# Altium schematic sheet be_mdv.SchDoc: =GlobalProjectName
size 410 x 297 mm; DocumentNumber: 1; SheetNumber: 1; SheetTotal: 2; PageSetup: Record=PageOptions|CenterHorizontal=True|CenterVertical=True|PrintScale=1.00|XCorrection=1.00|YCorrection=1.00|PrintKind=1|BorderSize=5000000|LeftOffset=0|BottomOffset=0|Orientation=2|PaperLength=1000|PaperWidth=1000|Scale=100|PaperSource=15|PrintQuality=1200|MediaType=1|DitherType=10|PaperKind=A3|PrintScaleMode=1; Weight: -; ScaleFactor: -
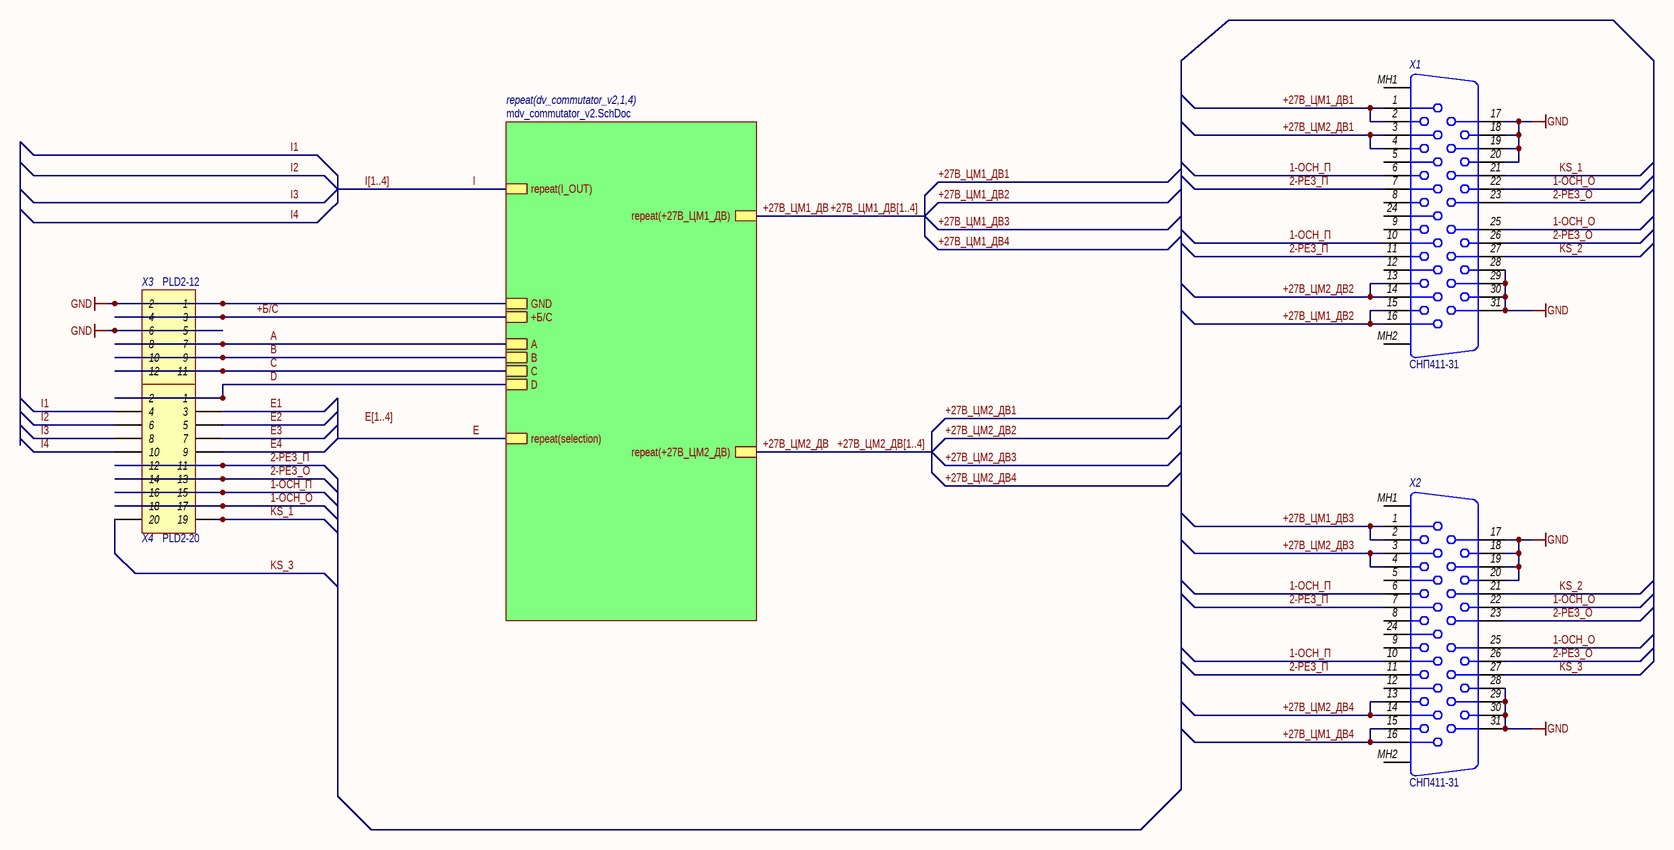
[diagram p0: be_mdv.SchDoc]

## Parts
X1  SNP411-31  [SNP411-31]  (value not drawn)
X2  SNP411-31  [SNP411-31]  (value not drawn)
X3  Header 2X12  [PLD2-12]  (value not drawn)
X4  Header 2X20  [PLD2-20]  (value not drawn)

## Sub-sheets
repeat(dv_commutator_v2,1,4) = mdv_commutator_v2.SchDoc: repeat(+27В_ЦМ2_ДВ), GND, repeat(+27В_ЦМ1_ДВ), +Б/С, repeat(selection), A, C, B, D, repeat(I_OUT)

## Nets
GND: X1.17 X1.18 X1.19 X1.20 X1.28 X1.29 X1.30 X1.31 X2.17 X2.18 X2.19 X2.20 X2.28 X2.29 X2.30 X2.31 X3.1 X3.2 X3.5 X3.6 ; sheet repeat(dv_commutator_v2,1,4)/GND
1-ОСН_О: X1.22 X1.25 X2.22 X2.25 X4.17 X4.18
1-ОСН_П: X1.6 X1.10 X2.6 X2.10 X4.15 X4.16
2-РЕЗ_О: X1.23 X1.26 X2.23 X2.26 X4.13 X4.14
2-РЕЗ_П: X1.7 X1.11 X2.7 X2.11 X4.11 X4.12
+27В_ЦМ1_ДВ: sheet repeat(dv_commutator_v2,1,4)/repeat(+27В_ЦМ1_ДВ)  [also labelled +27В_ЦМ1_ДВ[1..4]]
+27В_ЦМ1_ДВ1: X1.1 X1.2
+27В_ЦМ1_ДВ2: X1.15 X1.16
+27В_ЦМ1_ДВ3: X2.1 X2.2
+27В_ЦМ1_ДВ4: X2.15 X2.16
+27В_ЦМ2_ДВ: sheet repeat(dv_commutator_v2,1,4)/repeat(+27В_ЦМ2_ДВ)  [also labelled +27В_ЦМ2_ДВ[1..4]]
+27В_ЦМ2_ДВ1: X1.3 X1.4
+27В_ЦМ2_ДВ2: X1.13 X1.14
+27В_ЦМ2_ДВ3: X2.3 X2.4
+27В_ЦМ2_ДВ4: X2.13 X2.14
+Б/С: X3.3 X3.4 ; sheet repeat(dv_commutator_v2,1,4)/+Б/С
A: X3.7 X3.8 ; sheet repeat(dv_commutator_v2,1,4)/A
B: X3.9 X3.10 ; sheet repeat(dv_commutator_v2,1,4)/B
C: X3.11 X3.12 ; sheet repeat(dv_commutator_v2,1,4)/C
D: X4.1 X4.2 ; sheet repeat(dv_commutator_v2,1,4)/D
E: sheet repeat(dv_commutator_v2,1,4)/repeat(selection)
E1: X4.3
E2: X4.5
E3: X4.7
E4: X4.9
I: sheet repeat(dv_commutator_v2,1,4)/repeat(I_OUT)
I1: X4.4
I2: X4.6
I3: X4.8
I4: X4.10
KS_1: X1.21 X4.19
KS_2: X1.27 X2.21
KS_3: X2.27 X4.20

Not connected (* = marked no-connect by the designer): X1 5 8 9 12 24 MH1 MH2; X2 5 8 9 12 24 MH1 MH2

## Buses and harness runs
bus E[1..4]
bus I[1..4]

## Notes on the sheet
- Labels drawn without touching a wire or pin: E[1..4]
- Перв. примен.
- Справ. №
- Подп. и дата
- Инв. № дубл.
- Взам. инв. №
- Изм.
- Разраб.
- Лист
- № докум.
- Подп.
- Дата
- Литера
- Масса
- Масштаб
- Пров.
- Т.контр.
- Листов
- Н.контр.
- Утв.
- Инв. № подл.
- Форма 1 ГОСТ 2.104-2006
- Копировал
- Формат А3

## Library data of the parts
X1 X2 = СНП411-31: СНП411-31, распиновка со стороны платы; Назначение: Соединитель угловой на плату; Наименование: СНП411-31
X3 = Header 2X12: Header, 12-Pin, Dual row; Потребление, Вт: 0,0; Назначение: Header, 12-Pin, Dual row; Наименование: PLD2-12
X4 = Header 2X20: Header, 20-Pin, Dual row; Потребление, Вт: 0,0; Назначение: Header, 20-Pin, Dual row; Наименование: PLD2-20